# Altium schematic sheet 14_CONNECTOR.SchDoc
size A4; PageSetup: Record=PageOptions|CenterHorizontal=True|CenterVertical=True|PrintScale=0.97|XCorrection=1.00|YCorrection=1.00|PrintKind=0|BorderSize=5000000|LeftOffset=0|BottomOffset=0|Orientation=2|PaperLength=1000|PaperWidth=1000|Scale=100|PaperSource=7|PrintQuality=-4|MediaType=1|DitherType=10|PaperKind=A4|PrintScaleMode=1
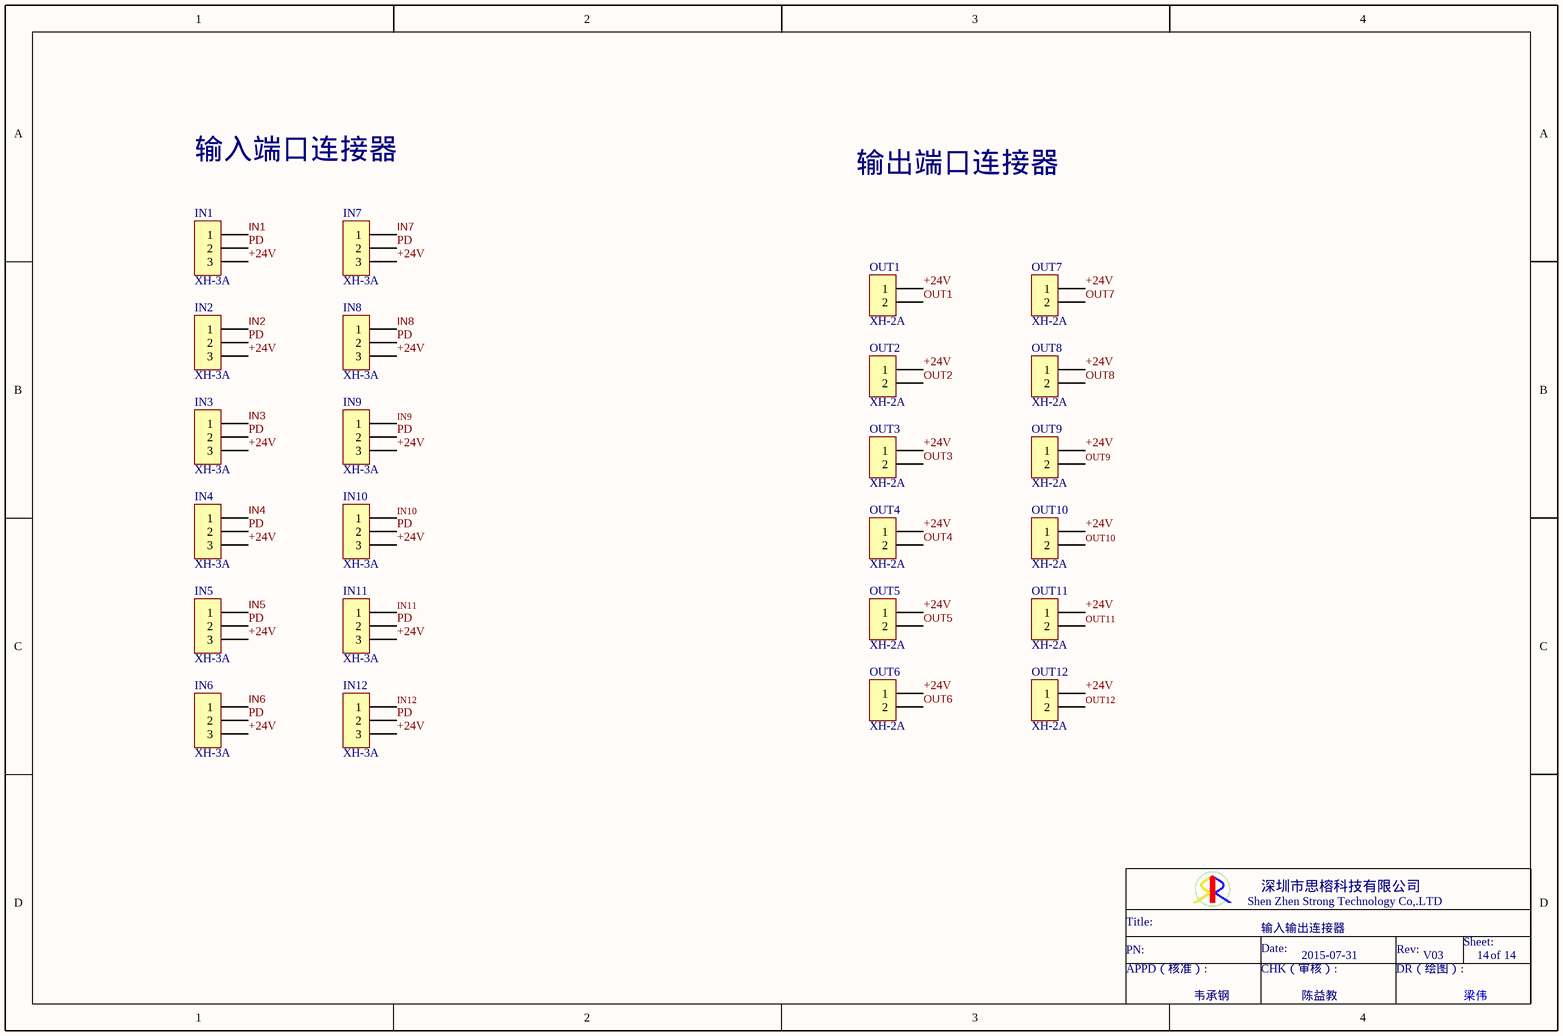
[diagram p0: 14_CONNECTOR.SchDoc]

## Parts
IN1  XH-3A  [CN3-2.54]
IN2  XH-3A  [CN3-2.54]
IN3  XH-3A  [CN3-2.54]
IN4  XH-3A  [CN3-2.54]
IN5  XH-3A  [CN3-2.54]
IN6  XH-3A  [CN3-2.54]
IN7  XH-3A  [CN3-2.54]
IN8  XH-3A  [CN3-2.54]
IN9  XH-3A  [CN3-2.54]
IN10  XH-3A  [CN3-2.54]
IN11  XH-3A  [CN3-2.54]
IN12  XH-3A  [CN3-2.54]
OUT1  XH-2A  [CN2-2.54]
OUT2  XH-2A  [CN2-2.54]
OUT3  XH-2A  [CN2-2.54]
OUT4  XH-2A  [CN2-2.54]
OUT5  XH-2A  [CN2-2.54]
OUT6  XH-2A  [CN2-2.54]
OUT7  XH-2A  [CN2-2.54]
OUT8  XH-2A  [CN2-2.54]
OUT9  XH-2A  [CN2-2.54]
OUT10  XH-2A  [CN2-2.54]
OUT11  XH-2A  [CN2-2.54]
OUT12  XH-2A  [CN2-2.54]

## Nets
+24V: IN1.3 IN2.3 IN3.3 IN4.3 IN5.3 IN6.3 IN7.3 IN8.3 IN9.3 IN10.3 IN11.3 IN12.3 OUT1.1 OUT2.1 OUT3.1 OUT4.1 OUT5.1 OUT6.1 OUT7.1 OUT8.1 OUT9.1 OUT10.1 OUT11.1 OUT12.1
IN1: IN1.1
IN2: IN2.1
IN3: IN3.1
IN4: IN4.1
IN5: IN5.1
IN6: IN6.1
IN7: IN7.1
IN8: IN8.1
IN9: IN9.1
IN10: IN10.1
IN11: IN11.1
IN12: IN12.1
OUT1: OUT1.2
OUT2: OUT2.2
OUT3: OUT3.2
OUT4: OUT4.2
OUT5: OUT5.2
OUT6: OUT6.2
OUT7: OUT7.2
OUT8: OUT8.2
OUT9: OUT9.2
OUT10: OUT10.2
OUT11: OUT11.2
OUT12: OUT12.2
PD: IN1.2 IN2.2 IN3.2 IN4.2 IN5.2 IN6.2 IN7.2 IN8.2 IN9.2 IN10.2 IN11.2 IN12.2

## Notes on the sheet
- 输入端口连接器
- 输出端口连接器
- 输入输出连接器
- 2015-07-31
- V03
- 14
- 韦承钢
- 陈益教
- Shen Zhen Strong Technology Co,.LTD
- 深圳市思榕科技有限公司
- Title:
- PN:
- APPD（核准）:
- Date:
- CHK（审核）:
- DR（绘图）:
- Rev:
- Sheet:
- of
- 梁伟

## Library data of the parts
IN1-IN12 = CON3
OUT1-OUT12 = CON2